# Altium schematic sheet USB_UART.SchDoc
size A4; SheetNumber: 4; SheetTotal: 6
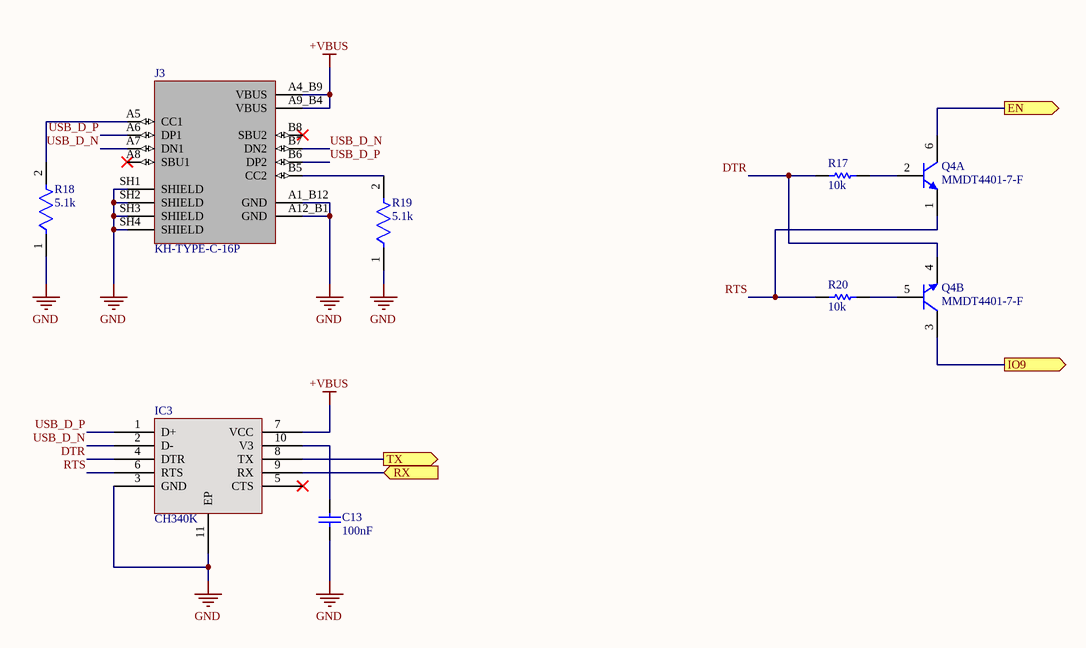
[diagram p0: USB_UART.SchDoc]

## Parts
C13  Capacitance: 100nF  [CAPC1608X90X35ML10T15]  (hidden comment: GRM188R71H104KA93D)
IC3  CH340K  [ESOP-10L]
J3  KH-TYPE-C-16P  [KINGHELM_KH-TYPE-C-16P]
Q4  MMDT4401-7-F  [Diodes SOT363-6P]  (parts A,B of 2)
R17  value 10k  [RESC1609X50X30NL8T20]  (hidden comment: CRCW060310K0FKEA)
R18  Resistance: 5.1k  [FP-CRCW0805-e3-MFG]  (hidden comment: CRCW08055K10FKEA)
R19  Resistance: 5.1k  [FP-CRCW0805-e3-MFG]  (hidden comment: CRCW08055K10FKEA)
R20  value 10k  [RESC1609X50X30NL8T20]  (hidden comment: CRCW060310K0FKEA)

## Ports
EN (out), IO9 (out), RX (in), TX (out)

## Nets
+VBUS: IC3.7(VCC) J3.A4_B9(VBUS) J3.A9_B4(VBUS)
GND: C13.1 IC3.3(GND) IC3.11(EP) J3.A1_B12(GND) J3.A12_B1(GND) J3.SH1(SHIELD) J3.SH2(SHIELD) J3.SH3(SHIELD) J3.SH4(SHIELD) R18.1 R19.1
DTR: IC3.4(DTR) Q4.4(E2) R17.2
EN: Q4.6(C1) ; port EN
IO9: Q4.3(C2) ; port IO9
RTS: IC3.6(RTS) Q4.1(E1) R20.2
RX: IC3.9(RX) ; port RX
TX: IC3.8(TX) ; port TX
USB_D_N: IC3.2(D-) J3.A7(DN1) J3.B7(DN2)
USB_D_P: IC3.1(D+) J3.A6(DP1) J3.B6(DP2)
NetC13_2: C13.2 IC3.10(V3)
NetJ3_A5: J3.A5(CC1) R18.2
NetJ3_B5: J3.B5(CC2) R19.2
NetQ4_2: Q4.2(B1) R17.1
NetQ4_5: Q4.5(B2) R20.1

Not connected (* = marked no-connect by the designer): IC3 5(CTS)*; J3 A8(SBU1)* B8(SBU2)*

## Library data of the parts
C13 = CMP-2100-03643-1: Chip Capacitor, 0.1 uF, +/- 10%, 50 V, -55 to 125 degC, 0603 (1608 Metric), RoHS, Tape and Reel; Manufacturer: Murata; Dielectric Material: Ceramic; Voltage Rating: 50V; Dielectric: X7R; Insulation Resistance: 10GR; Case Code (Metric): 1608; Lead Free: LeadFree; Depth: 0.8mm; Number of Pins: 2; Radiation Hardening: No; Case/Package: 0603; Manufacturer URL: http://www.murata.com/; Packaging: TapeandReel; Length: 1.6mm; Contact Plating: Tin; Datasheet URL: http://psearch.en.murata.com/capacitor/product/GRM188R71H104KA93%23.pdf; Tolerance: 10%; Case Code (Imperial): 0603; Min Operating Temperature: -55degC; RoHSCompliant: true; Voltage: 50V; Termination: SMD/SMT; Mount: SurfaceMount; Material: Ceramic; Package Quantity: 1; Height: 0.8mm; Thickness: 0.035inch; REACH SVHC: NoSVHC; Max Operating Temperature: 125degC; Width: 0.8mm; Package Reference: 0603; Voltage Rating (DC): 50V; Datasheet Version: 42675.0; Package Description: 2-Pin Surface Mount Device, Body 1.6 x 0.8 mm
IC3 = CH340K: USB to Serial Port Chip CH340
J3 = KH-TYPE-C-16P: MF: kinghelm; Value: *; SnapEDA_Link: https://www.snapeda.com/parts/KH-TYPE-C-16P/Ki/view-part/?ref=snap; MP: KH-TYPE-C-16P; Check_prices: https://www.snapeda.com/parts/KH-TYPE-C-16P/Ki/view-part/?ref=eda; Availability: Not in stock; Price: None; Package: None
Q4 = Diodes MMDT4401-7-F: Small Signal Bipolar Transistor, 2-Element, NPN, Silicon; Manufacturer: Diodes; Package Body Material: Plastic; Additional Feature: HIGH RELIABILITY; Max Collector Current: 600mA; Collector-emitter Voltage-Max: 40V; DC Current Gain-Min (hFE): 40; Number of Elements: 2; Power Dissipation-Max (Abs): 200mW; Time @ Peak Reflow Temperature-Max (s): 40s; Transistor Application: SWITCHING; Frequency: 250MHz; Turn-off Time-Max (toff): 255ns; Turn-on Time-Max (ton): 35ns; Qualification Status: Not Qualified; Supplier: Future Electronics; Supplier Part Number: 2830255; Manufacturer Part Number: MMDT4401-7-F; RoHS: Yes; Category: BJTs; Stock: 108000; Pricing: 3000=0,0444, 9000=0,0428, 15000=0,0421, 60000=0,0401, 90000=0,0389 (USD); Pins: 6; Package Shape: Rectangular; Terminal Finish: Tin; Transistor Element Material: SILICON; Max Operating Temperature: 150°C; JESD-609 Code: e3; Polarity/Channel Type: NPN; JESD-30 Code: R-PDSO-G6; Moisture Sensitivity Level: 1; Package Style: SMALL OUTLINEMeter; Peak Reflow Temperature (Cel): 260°C; Surface Mount: Yes; Terminal Form: Gull Wing; Terminal Position: DUAL; Reach SVHC Compliant: Yes; RoHS Compliant: Yes; ComponentLink1URL: https://datasheet.ciiva.com:443/pdfs/VipMasterIC/IC/DIOD/DIODS11071/DIODS11071-1.pdf?src-supplier=IHS+Markit; ComponentLink1Description: https://datasheet.ciiva.com:443/pdfs/VipMasterIC/IC/DIOD/DIODS11071/DIODS11071-1.pdf?src-supplier=IHS+Markit; ComponentLink2URL: https://datasheet.ciiva.com/5782/ds30111-5782768.pdf?src-supplier=Farnell; ComponentLink2Description: https://datasheet.ciiva.com/5782/ds30111-5782768.pdf?src-supplier=Farnell; ComponentLink3URL: https://datasheet.ciiva.com/5782/ds30111-5782768.pdf?src-supplier=Avnet; ComponentLink3Description: https://datasheet.ciiva.com/5782/ds30111-5782768.pdf?src-supplier=Avnet; ComponentLink4URL: https://datasheet.ciiva.com/17059/0900766b80e49824-17059229.pdf?src-supplier=Allied+Electronics; ComponentLink4Description: https://datasheet.ciiva.com/17059/0900766b80e49824-17059229.pdf?src-supplier=Allied+Electronics; ComponentLink5URL: https://datasheet.ciiva.com/968/ds30111-968196.pdf?src-supplier=Digikey; ComponentLink5Description: https://datasheet.ciiva.com/968/ds30111-968196.pdf?src-supplier=Digikey; ComponentLink6URL: https://datasheet.ciiva.com/968/ds30111-968197.pdf?src-supplier=Digikey; ComponentLink6Description: https://datasheet.ciiva.com/968/ds30111-968197.pdf?src-supplier=Digikey; ComponentLink7URL: https://datasheet.ciiva.com/968/ds30111-968198.pdf?src-supplier=Digikey; ComponentLink7Description: https://datasheet.ciiva.com/968/ds30111-968198.pdf?src-supplier=Digikey; ComponentLink8URL: https://datasheet.ciiva.com/15224/getdatasheetpartid-240136-15224396.pdf?src-supplier=Verical; ComponentLink8Description: https://datasheet.ciiva.com/15224/getdatasheetpartid-240136-15224396.pdf?src-supplier=Verical
R17 R20 = CMP-1666-00005-4: Chip Resistor, 10 KOhm, +/- 1%, 100 mW, -55 to 155 degC, 0603 (1608 Metric), RoHS, Tape and Reel; Manufacturer: Vishay Semiconductor; Voltage Rating: 75 V; Max Operating Temperature: 155 degC; PackageDescription: 2-Pin Surface Mount Device, Body 1.575 x 0.85 mm; ComponentLink1Description: Manufacturer URL; RoHSCompliant: true; PackageReference: 0603; REACH SVHC: Unknown; Length: 1.55 mm; DatasheetVersion: 06/2012; Packaging: Tape and Reel; Min Operating Temperature: -55 degC; Mounting Technology: Surface Mount; ComponentLink2URL: https://datasheet.ciiva.com/11809/0900766b80d98afc-11809037.pdf; Height: 0.45 mm; ComponentLink2Description: Datasheet; Package Quantity: 5000; ComponentLink1URL: http://www.vishay.com/
R18 R19 = CMP-2001-04024-2: RES Thick Film, 5.1kΩ, 1%, 0.125W, 100ppm/°C, 0805; Power Rating: 125mW; Voltage Rating (DC): 150V; Packaging: Tape and Reel; Case Code (Metric): 2012; Contact Plating: Tin; Case Code (Imperial): 0805; Depth: 1.25mm; Tolerance: 1%; Width: 0.049inch; Temperature Coefficient: 100ppm/°C; Max Power Dissipation: 125mW; Military Standard: Not; Lead Free: Lead Free; Mount: Surface Mount; Min Operating Temperature: -55°C; Package Quantity: 10; Weight: 0.000194oz; Height: 0.45mm; Number of Terminations: 2; Max Operating Temperature: 155°C; Termination: SMD/SMT; Case/Package: 0805; Composition: Thick Film; Voltage Rating: 150V; Length: 2mm; Features: Automotive AEC-Q200; Radiation Hardening: No